# EAGLE design TEST_PROD_BATT_BOT (EAGLE 9.6.2)
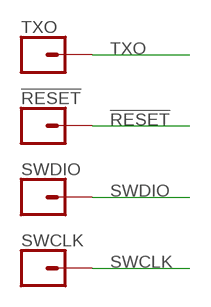
[diagram p0: schematic, sheet 1]

## Parts
!RESET  CONN_01POGOPIN_HOLE_LARGE  [1X01_POGOPIN_HOLE_0.061_DIA]
SWCLK  CONN_01POGOPIN_HOLE_LARGE  [1X01_POGOPIN_HOLE_0.061_DIA]
SWDIO  CONN_01POGOPIN_HOLE_LARGE  [1X01_POGOPIN_HOLE_0.061_DIA]
TXO  CONN_01POGOPIN_HOLE_LARGE  [1X01_POGOPIN_HOLE_0.061_DIA]

## Nets
!RESET: !RESET.2
SWCLK: SWCLK.2
SWDIO: SWDIO.2
TXO: TXO.2

## Library data of the parts
!RESET SWCLK SWDIO TXO = SparkFun-Connectors:CONN_01: Single connection point. Often used as Generic Header-pin footprint for 0.1 inch spaced/style header connections On any of the 0.1 inch spaced packages, you can populate with these: Break Away Headers - Straight <https://www.sparkfun.com/products/116> (PRT-00116) Break Away Male Headers - Right Angle <https://www.sparkfun.com/products/553> (PRT-00553) Female Headers <https://www.sparkfun.com/products/115> (PRT-00115) Break Away Headers - Machine Pin <https://www.sparkfun.com/products/117> (PRT-00117) Break Away Female Headers - Swiss Machine Pin <https://www.sparkfun.com/products/743> (PRT-00743) This device is also useful as a general connection point to wire up your design to another part of your project. Our various solder wires solder well into these plated through hole pads. Hook-Up Wire - Assortment (Stranded, 22 AWG) <https://www.sparkfun.com/products/11375> (PRT-11375) Hook-Up Wire - Assortment (Solid Core, 22 AWG) <https://www.sparkfun.com/products/11367> (PRT-11367) View the entire wire category on our website here <https://www.sparkfun.com/categories/141> Special notes: SMTSO-256-ET is a "flush mount" nut for a 4-40 screw. We mostly use this on specialty testbeds; it is a nice way to connect hardware to your PCB at an adjustable hieght. Also note, the SNAP packages are for using a snappable style connector. We sell a baggie of snaps and they are also used on two LilyPad designs: Snap Assortment - 30 pack (male and female) <https://www.sparkfun.com/products/11347> (DEV-11347) LilyPad Arduino SimpleSnap <https://www.sparkfun.com/products/10941> (DEV-10941) LilyPad SimpleSnap Protoboard <https://www.sparkfun.com/products/10940> (DEV-10940)

## Board
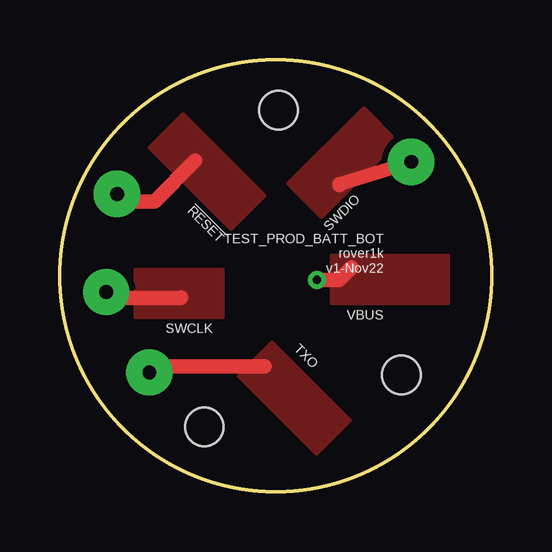
[diagram p1: board, top side]
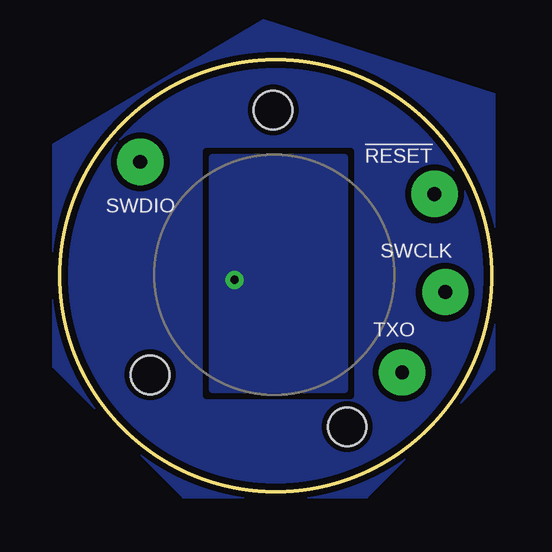
[diagram p2: board, bottom side, seen from below]

Size 18 x 18 mm. Coordinates in mm from the lower left corner, seen from the top.
Outline: circle at 9,9 radius 9
Copper layers (1*16): Top 0.035mm / dielectric 1.5mm / Bottom 0.035mm
Design rules "default *": minimum track width 0.00038125mm, minimum drill 0.35mm, track to track 8mil, track to pad 8mil, pad to pad 8mil, via to via 8mil, smd to smd 5mil, copper to edge 8mil, drill to drill 8mil, minimum pad ring 10mil, minimum via ring 8mil, stop-mask expansion 2mil, vias tented up to drill 50mil, thermal gap 10mil
Holes 1.6 mm at 14.24,4.87 6.02,2.7 9.11,15.91

### Footprints (pad centres in the part's own frame; a part is rotated, then mirrored left to right if it is on the bottom)
1X01_POGOPIN_HOLE_0.061_DIA = drill 0.58 pad 1.93: 2 0,0

### Placement (x,y rotation side)
!RESET  2.38,12.41 0 top
SWCLK  1.93,8.32 0 top
SWDIO  14.65,13.75 0 top
TXO  3.73,4.97 0 top

### Tracks (layer width: path | path; a pad name or v marks a point on that pad's centre or on a via)
!RESET
  Top 0.61: !RESET.2 2.69,12.1 3.94,12.1 5.64,13.8
  pour Top: 7.13,10.92 8.54,12.34 5.13,15.75 3.71,14.34
GND
  pour Bottom (isolate 0.254, rank 2): 9.51,19.65 18.28,14.46 18.28,5.19 12.86,-0.23 5.2,-0.23 -0.12,5.09 -0.12,16.57
SWCLK
  Top 0.61: SWCLK.2 2.18,8.07 5.03,8.07 5.05,8.09
  pour Top: 3.14,9.25 3.14,7.25 6.81,7.25 6.81,9.25
SWDIO
  Top 0.61: SWDIO.2 11.65,12.82 11.65,12.78
  pour Top: 9.49,12.84 10.91,11.43 14.08,14.6 12.67,16.02
TXO
  Top 0.61: TXO.2 3.97,5.21 8.53,5.21
  pour Top: 10.69,1.55 12.11,2.97 8.83,6.24 7.42,4.82
VBUS  (via drill 0.35)
  Top 0.61: v10.72,8.83 11.63,8.83 12.15,9.35
  pour Bottom: 6.13,13.93 11.63,13.93 11.63,4.27 6.13,4.27
  pour Top: 11.32,9.85 11.32,7.85 16.2,7.85 16.2,9.85

### Text on the board
tNames: !RESET | SWDIO | TEST_PROD_BATT_BOT / rover1k / v1-Nov22 | VBUS | SWCLK | TXO